# EAGLE design ultra-violet-tooth-sensor-mk-3.0 (EAGLE 6.5.0)
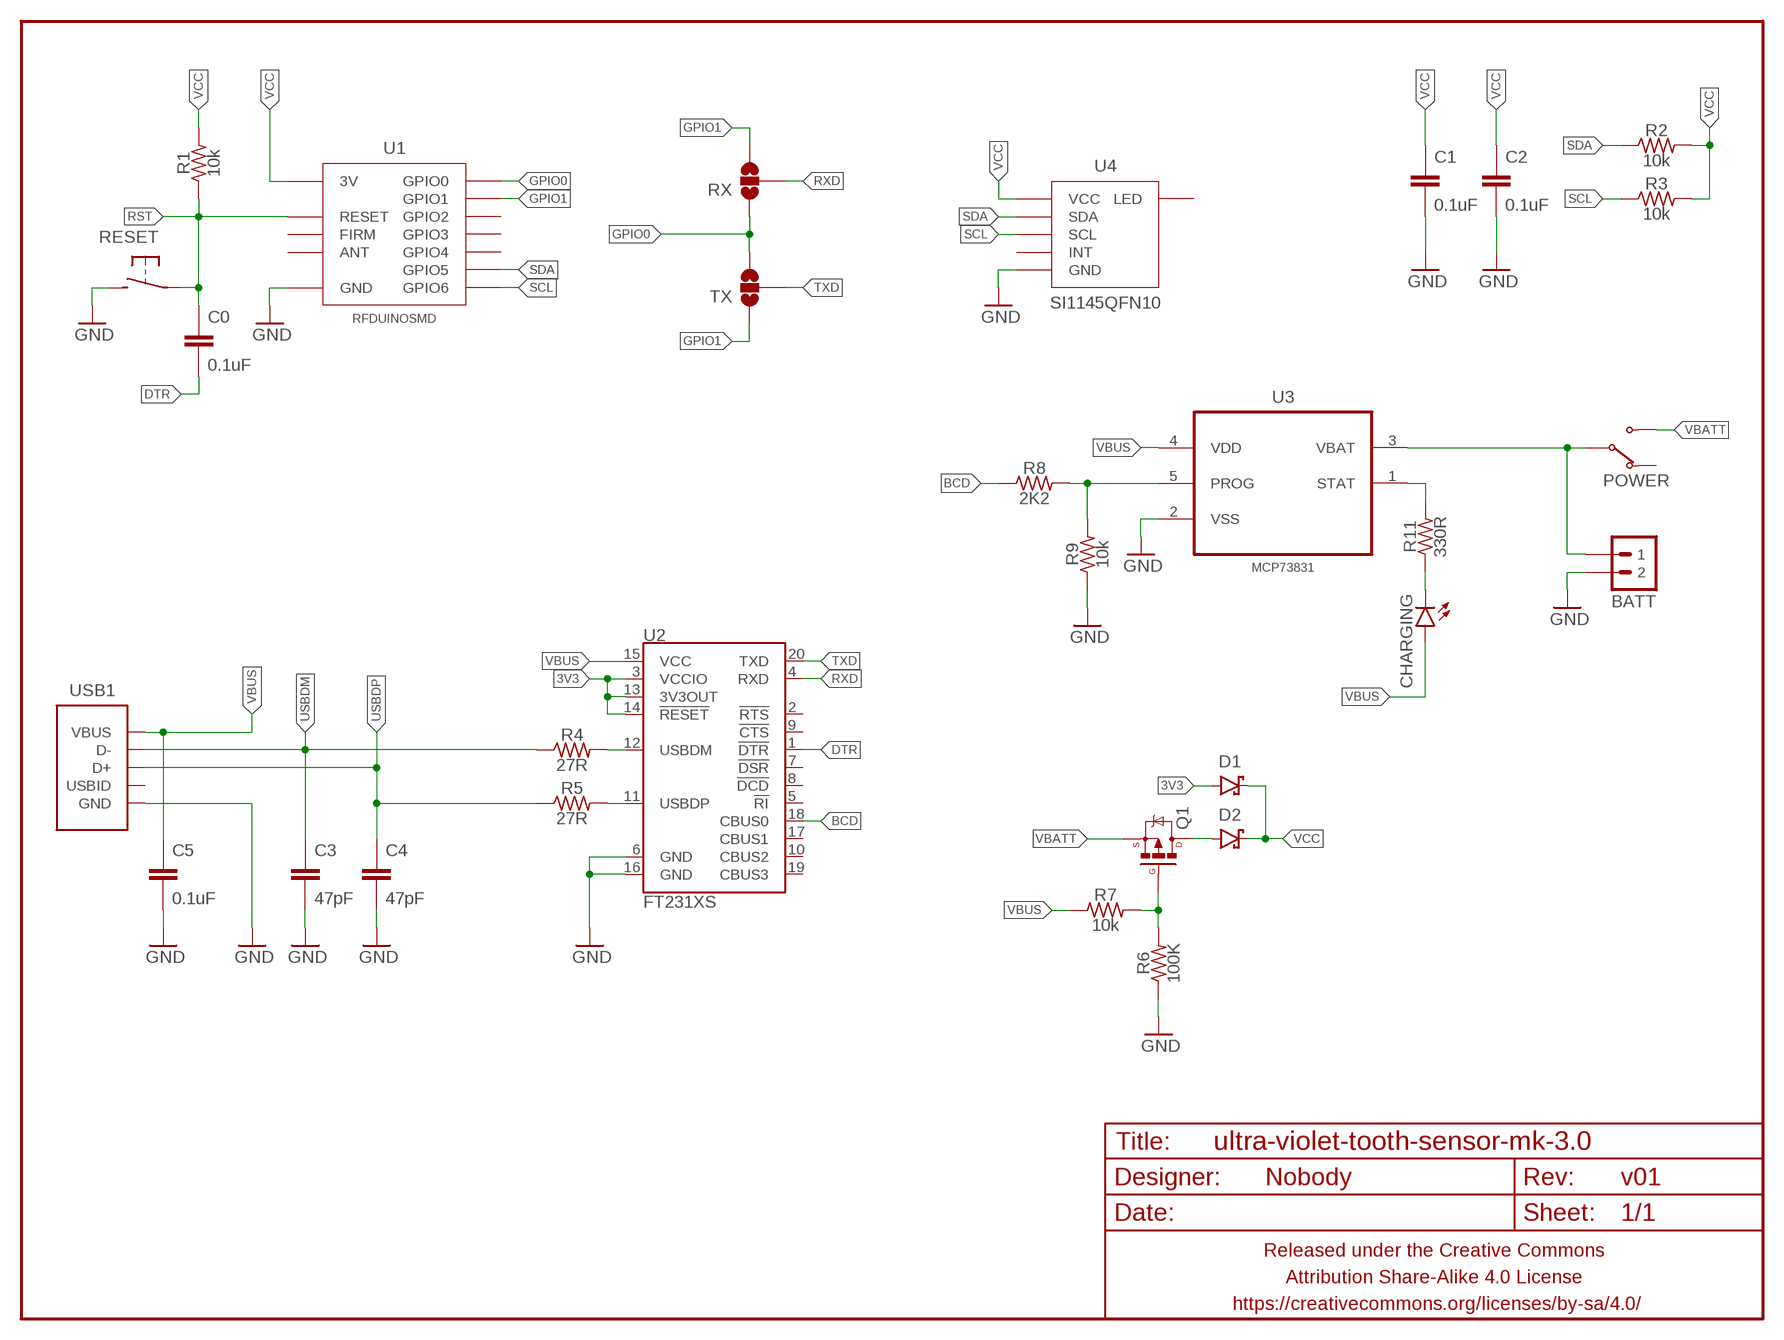
[diagram p0: schematic, sheet 1]

## Parts
BATT  M02JST-2MM-SMT  [JST-2-SMD]
C0  0.1uF  CAPACITOR-CERAMICC0603  [C0603]
C1  0.1uF  CAPACITOR-CERAMICC0603  [C0603]
C2  0.1uF  CAPACITOR-CERAMICC0603  [C0603]
C3  47pF  CAPACITOR-CERAMICC0603  [C0603]
C4  47pF  CAPACITOR-CERAMICC0603  [C0603]
C5  0.1uF  CAPACITOR-CERAMICC0603  [C0603]
CHARGING  LED1206  [LED-1206]
D1  DIODE-SCHOTTKYSMA  [SMA-DIODE-SCHOTTKY]
D2  DIODE-SCHOTTKYSMA  [SMA-DIODE-SCHOTTKY]
FRAME1  FRAME-LETTERNO_PACKAGE  [DUMMY]
POWER  SWITCH-SPDTPTH-RA-2.54MM  [SPDT-RA-2.54MM]
Q1  MOSFET-PCHANNELIRLML2244  [SOT23-3]
R1  10k  RESISTORR0603  [R0603]
R2  10k  RESISTORR0603  [R0603]
R3  10k  RESISTORR0603  [R0603]
R4  27R  RESISTORR0603  [R0603]
R5  27R  RESISTORR0603  [R0603]
R6  100K  RESISTORR0603  [R0603]
R7  10k  RESISTORR0603  [R0603]
R8  2K2  RESISTORR0603  [R0603]
R9  10k  RESISTORR0603  [R0603]
R11  330R  RESISTORR0603  [R0603]
RESET  SPST-NO-TACT3MM-RA  [TACTILE-PTH-SIDE]
RX  JUMPER-PAD-3-NOFULL_BOX_SILK  [PAD-JUMPER-3-NO_YES_SILK_FULL_BOX]
TX  JUMPER-PAD-3-NOFULL_BOX_SILK  [PAD-JUMPER-3-NO_YES_SILK_FULL_BOX]
U1  RFDUINOSMD  [RFDUINO-SMD]
U2  FT231XS  [SSOP20_L]
U3  MCP73831  MCP73831T-2ACI/OT  [SOT95P280X145-5N]
U4  SI1145QFN10  [SI1145]
USB1  USB-ABCOMBO  [USB-MICRO-B-FCI-CUTOUT]

## Nets
3V3: D1.A U2.3(VCCIO) U2.13(3V3OUT) U2.14(!RESET)
BCD: R8.1 U2.18(CBUS0)
DTR: C0.2 U2.1(!DTR)
GND: BATT.1 C1.2 C2.2 C3.2 C4.2 C5.2 R6.1 R9.1 RESET.2 U1.GND@1(GND) U1.GND@2(GND) U1.GND@3(GND) U1.GND@4(GND) U1.GND@5(GND) U1.GND@6(GND) U1.GND@7(GND) U1.GND@8(GND) U2.6(GND) U2.16(GND) U3.2(VSS) U4.GND USB1.5(GND) USB1.P$1(GND) USB1.P$2(GND)
GPIO0: RX.1 TX.3 U1.GPIO0
GPIO1: RX.3 TX.1 U1.GPIO1
N$1: Q1.1(G) R6.2 R7.2
N$3: BATT.2 POWER.2(COM) U3.3(VBAT)
N$4: R11.2 U3.1(STAT)
N$5: CHARGING.C R11.1
N$6: D2.A Q1.3(D)
N$14: R4.2 U2.12(USBDM)
N$15: R5.2 U2.11(USBDP)
PROG: R8.2 R9.2 U3.5(PROG)
RST: C0.1 R1.1 RESET.1 U1.RESET
RXD: RX.2 U2.4(RXD)
SCL: R3.1 U1.GPIO6 U4.SCL
SDA: R2.1 U1.GPIO5 U4.SDA
TXD: TX.2 U2.20(TXD)
USBDM: C3.1 R4.1 USB1.2(D-)
USBDP: C4.1 R5.1 USB1.3(D+)
VBATT: POWER.3(NO) Q1.2(S)
VBUS: C5.1 CHARGING.A R7.1 U2.15(VCC) U3.4(VDD) USB1.1(VBUS)
VCC: C1.1 C2.1 D1.C D2.C R1.2 R2.2 R3.2 U1.3V U4.VCC@1(VCC) U4.VCC@2(VCC) U4.VCC@3(VCC)
Unconnected: POWER.1(NC) U1.ANT U1.FACTORY(FIRM) U1.GPIO2 U1.GPIO3 U1.GPIO4 U2.2(!RTS) U2.5(!RI) U2.7(!DSR) U2.8(!DCD) U2.9(!CTS) U2.10(CBUS2) U2.17(CBUS1) U2.19(CBUS3) U4.INT U4.LED USB1.4(USBID)

## Library data of the parts
BATT = A_butts:M02: Standard 2-pin 0.1" header. Use with - straight break away headers ( PRT-00116) - right angle break away headers (PRT-00553) - swiss pins (PRT-00743) - machine pins (PRT-00117) - female headers (PRT-00115) Molex polarized connector foot print use with: PRT-08233 with associated crimp pins and housings. 2.54_SCREWTERM for use with PRT-10571. 3.5mm Screw Terminal footprints for PRT-08084 5mm Screw Terminal footprints for use with PRT-08433; PROD_ID: CONN-08352
C0 C1-C5 = A_butts:CAPACITOR-CERAMIC: CAPACITOR, European symbol
CHARGING = A_butts:LED: LEDs Standard schematic elements and footprints for 5mm, 3mm, 1206, and 0603 sized LEDs. 5mm - Spark Fun Electronics SKU : COM-00529 (and others)
D1 D2 = A_butts:DIODE-SCHOTTKY: Schottky diodes in SFE's production catalog BAT20J 1A 23V 0.62Vf RB751 120mA 40V 0.37Vf PMEG4005EJ 0.5A 40V 0.42Vf MBRA140 1A 40V 0.5Vf B340A 3A 40V SMA
FRAME1 = A_butts:FRAME-LETTER: Schematic Frame Standard 8.5x11 US Letter frame; DESIGNER: Nobody; VERSION: v01
POWER = A_butts:SWITCH-SPDT
Q1 = A_butts:MOSFET-PCHANNEL: Generic PMOSFET IRLML2244 - TRANS-11153 (SOT-23 -20V -4.3A) (1.Gate 2.Source 3.Drain) FQP27P06 - COM-10349 <http://www.sparkfun.com/products/10349> (TO-220 -60V -27A) (1.Gate 2.Source 3.Drain); PROD_ID: TRANS-11153
R1-R9 R11 = A_butts:RESISTOR: RESISTOR, American symbol
RESET = A_butts:SPST-NO-TACT
RX TX = A_butts:JUMPER-PAD-3-NO
U1 = A_butts:RFDUINO
U2 = A_butts:FT231X: FTDI FT231X Full Speed USB to Full-handshake UART This USB2.0 Full Speed IC offers a compact bridge to full handshake UART interfaces. The device is a UART, capable of operating up to 3MBaud, with low power consumption (8mA). The FT231X includes the complete FT-X series feature set and enables USB to be added into a system design quickly and easily over a UART interface.; PROD_ID: IC-11524; VALUE: FTS31XS-U
U3 = A_butts:MCP73831T-2ACI/OT: Charge Management Controller; MPN: MCP73831T-2ACI/OT; OC_FARNELL: 1332158; OC_NEWARK: 56K7045; PACKAGE: SOT-5; SUPPLIER: Microchip
U4 = A_butts:SI1145
USB1 = A_butts:USB-AB: This is a USB AB connector that is compatible with USB OTG. i.e. this connector can serve as a host or device

## Board
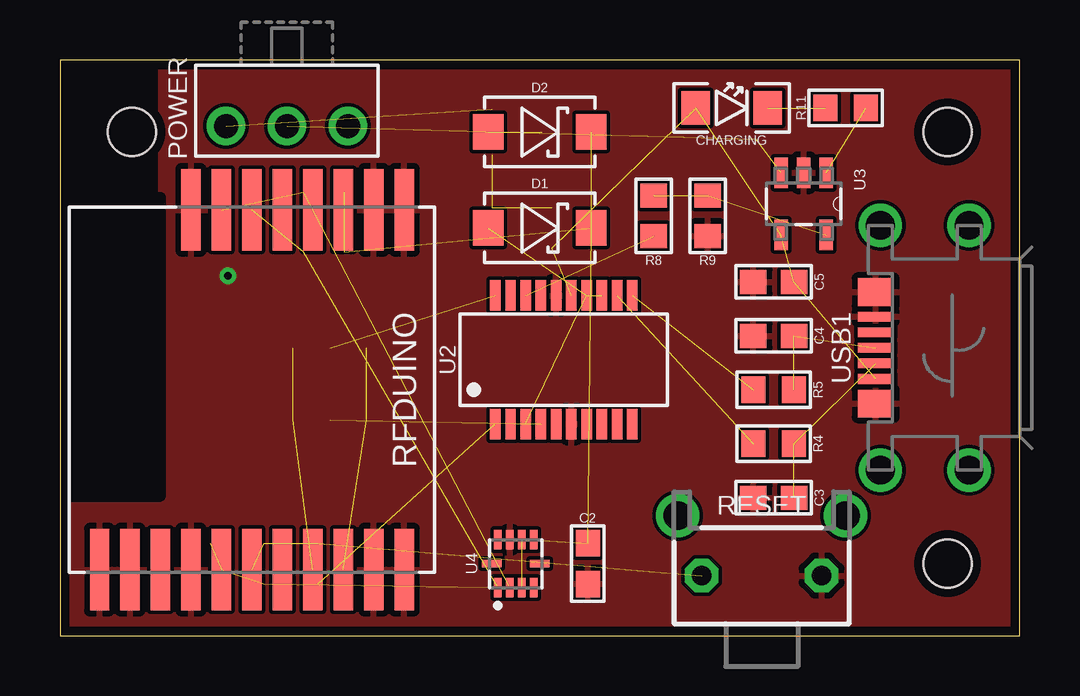
[diagram p1: board, top side]
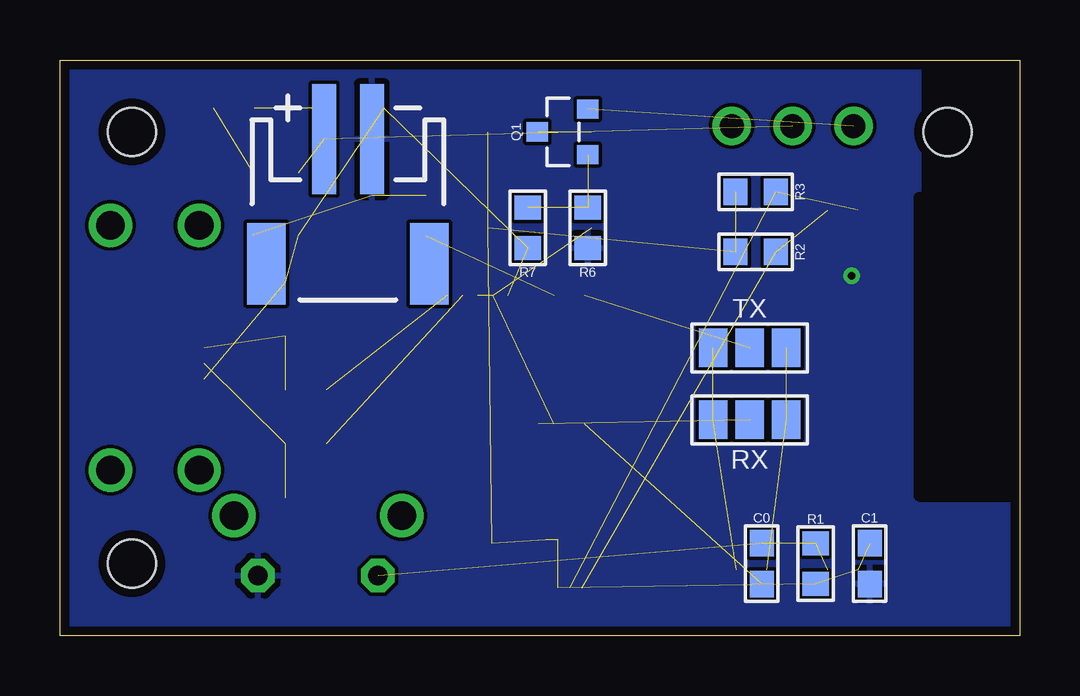
[diagram p2: board, bottom side, seen from below]

Size 40 x 24 mm. Coordinates in mm from the lower left corner, seen from the top.
Outline: 0,24 0,0 40,0 40,24 0,24
Copper layers (1*16): Top 0.0356mm / dielectric 1.5011mm / Bottom 0.0356mm
Design rules "LaenPCBOrder_2": minimum track width 6mil, minimum drill 13mil, track to track 6mil, track to pad 6mil, pad to pad 6mil, via to via 6mil, smd to smd 6mil, copper to edge 15mil, drill to drill 6mil, minimum pad ring 7mil, minimum via ring 7mil, stop-mask expansion 3mil, vias tented up to drill 20mil, thermal gap 10mil
Holes 2 mm at 3,21 37,21 37,3

### Footprints (pad centres in the part's own frame; a part is rotated, then mirrored left to right if it is on the bottom)
JST-2-SMD = smd 1 x 4.6: 1 -1,-3.7; 2 1,-3.7 | smd 1.6 x 3.4: NC1 -3.4,1.5; NC2 3.4,1.5
C0603 = smd 1.1 x 1: 1 -0.85,0; 2 0.85,0
LED-1206 = smd 1.2 x 1.4: A -1.5,0; C 1.5,0
SMA-DIODE-SCHOTTKY = smd 1.27 x 1.47: A -2.15,0; C 2.15,0
SPDT-RA-2.54MM = drill 1 pad 1.6: 1 0,0; 2 2.54,0; 3 5.08,0
SOT23-3 = smd 0.8 x 0.9: 1 -0.95,-1; 2 0.95,-1; 3 0,1.1
R0603 = smd 1 x 1.1: 1 -0.85,0; 2 0.85,0
TACTILE-PTH-SIDE = drill 0.8 pad 1.4 octagon: 1 -2.5,0; 2 2.5,0 | drill 1.2 pad 1.778: ANCHOR1 -3.5,2.5; ANCHOR2 3.5,2.5
PAD-JUMPER-3-NO_YES_SILK_FULL_BOX = smd 1.2 x 1.6: 1 -1.524,0; 2 0,0; 3 1.524,0
RFDUINO-SMD = smd 3.4 x 0.8: 3V 7.5,-1.27; ANT 7.5,-3.81; FACTORY 7.5,1.27; GND@1 -7.5,6.35; GND@2 -7.5,5.08; GND@3 -7.5,-2.54; GND@4 7.5,-6.35; GND@5 7.5,-5.08; GND@6 7.5,-2.54; GND@7 7.5,5.08; GND@8 7.5,6.35; GPIO0 7.5,2.54; GPIO1 7.5,3.81; GPIO2 -7.5,3.81; GPIO3 -7.5,2.54; GPIO4 -7.5,1.27; GPIO5 -7.5,0; GPIO6 -7.5,-1.27; RESET 7.5,0
SSOP20_L = smd 0.43 x 1.27: 1 -2.857,-2.68; 2 -2.223,-2.68; 3 -1.587,-2.68; 4 -0.953,-2.68; 5 -0.318,-2.68; 6 0.318,-2.68; 7 0.953,-2.68; 8 1.587,-2.68; 9 2.223,-2.68; 10 2.857,-2.68; 11 2.857,2.68; 12 2.223,2.68; 13 1.587,2.68; 14 0.953,2.68; 15 0.318,2.68; 16 -0.318,2.68; 17 -0.953,2.68; 18 -1.587,2.68; 19 -2.223,2.68; 20 -2.857,2.68
SOT95P280X145-5N = smd 1.27 x 0.559: 1 -1.295,0.94; 2 -1.295,0; 3 -1.295,-0.94; 4 1.295,-0.94; 5 1.295,0.94
SI1145 = smd 0.8 x 0.3: GND 1,0.25; INT -1,-0.75; LED 1,0.75; SCL -1,0.25; SDA -1,0.75; VCC@1 -1,-0.25; VCC@2 1,-0.25; VCC@3 1,-0.75 | smd 0.3 x 0.8: NC@1 0,1; NC@2 0,-1
USB-MICRO-B-FCI-CUTOUT = smd 0.4 x 1.5: 1 -1.3,0; 2 -0.65,0; 3 0,0; 4 0.65,0; 5 1.3,0 | smd 1.15 x 1.5: P$1 -2.325,0; P$2 2.325,0 | drill 1.2: P$3 -5.1,-0.2; P$4 5.1,-0.2; P$5 -5.1,-3.9; P$6 5.1,-3.9

### Placement (x,y rotation side)
BATT  28,17 180 bottom
C0  10.75,3 270 bottom
C1  6.25,3 270 bottom
C2  22,3 270 top
C3  29.75,5.75 180 top
C4  29.75,12.5 180 top
C5  29.75,14.75 180 top
CHARGING  28,22 0 top
D1  20,17 0 top
D2  20,21 0 top
FRAME1  0,0 180 top
POWER  12,21.25 180 top
Q1  19,21 90 bottom
R1  8.5,3 270 bottom
R2  11,16 180 bottom
R3  11,18.5 180 bottom
R4  29.75,8 180 top
R5  29.75,10.25 180 top
R6  18,17 90 bottom
R7  20.5,17 90 bottom
R8  24.75,17.5 90 top
R9  27,17.5 90 top
R11  32.75,22 0 top
RESET  29.25,2.5 0 top
RX  11.25,9 180 bottom
TX  11.25,12 0 bottom
U1  8,10.25 270 top
U2  21,11.5 0 top
U3  31,18 270 top
U4  19,3 90 top
U$1  [CC-BY-SA-4.0-NO-URL]  30.95,33.05 90 top  (outside the outline)
U$3  [OSHWLOGO_TOP_0.2]  24.45,36.15 0 top  (outside the outline)
USB1  34,12 90 top

### Tracks (layer width: path | path; a pad name or v marks a point on that pad's centre or on a via)
3V3  (3 unrouted)
BCD  (1 unrouted)
DTR  (1 unrouted)
GND  (via drill 0.33)
  other vias: 7,15
  pour Top (isolate 0.152, rank 6): 40.1,24.1 40.1,-0.1 -0.1,-0.1 -0.1,8 4.15,8 4.15,24.1
  pour Bottom (isolate 0.152, rank 6): 40.1,24.1 40.1,-0.1 -0.1,-0.1 -0.1,8 4.15,8 4.15,24.1
GPIO0  (2 unrouted)
GPIO1  (2 unrouted)
N$1  (2 unrouted)
N$3  (2 unrouted)
N$4  (1 unrouted)
N$5  (1 unrouted)
N$6  (1 unrouted)
N$14  (1 unrouted)
N$15  (1 unrouted)
PROG  (2 unrouted)
RST  (3 unrouted)
RXD  (1 unrouted)
SCL  (2 unrouted)
SDA  (2 unrouted)
TXD  (1 unrouted)
USBDM  (2 unrouted)
USBDP  (2 unrouted)
VBATT  (1 unrouted)
VBUS  (5 unrouted)
VCC  (10 unrouted)

### Text on the board
tPlace: by schizobovine / <sean@yak.net>